# Altium schematic sheet 核心板.SchDoc
size A4; SheetNumber: 1; SheetTotal: 3
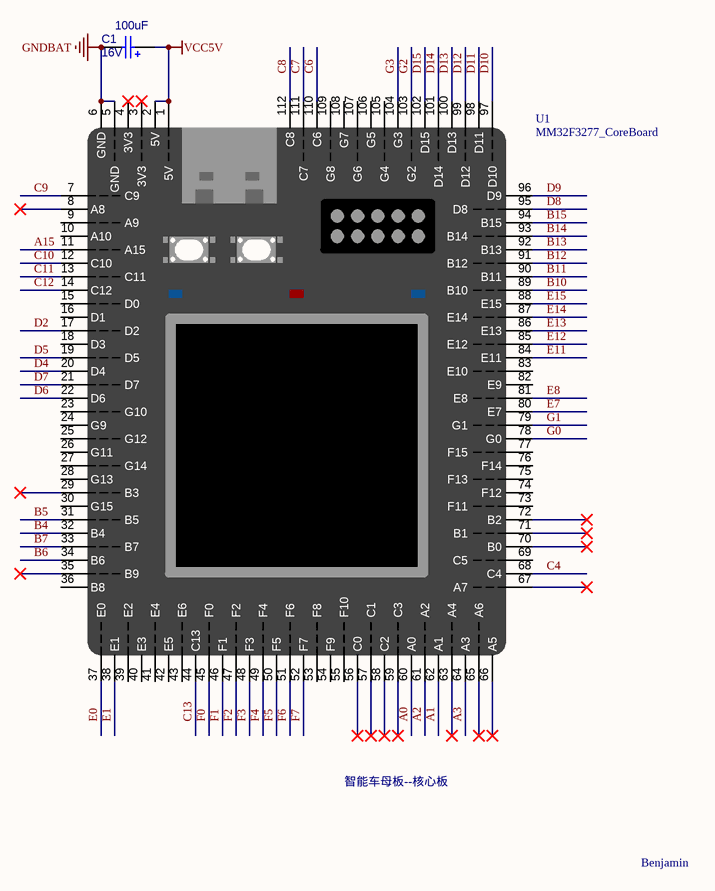
[diagram p0: 核心板.SchDoc]

## Parts
C1  value 100uF  Voltage: 16V  [CAPT3528]  (hidden comment: 100uF 16V)
U1  MM32F3277_CoreBoard  [MM32F3277_CoreBoard]

## Nets
GNDBAT: C1.2 U1.5(GND) U1.6(GND)
VCC5V: C1.1 U1.1(5V) U1.2(5V)
A0: U1.60(A0)
A1: U1.62(A1)
A2: U1.61(A2)
A3: U1.64(A3)
A15: U1.11(A15)
B4: U1.32(B4)
B5: U1.31(B5)
B6: U1.34(B6)
B7: U1.33(B7)
B10: U1.89(B10)
B11: U1.90(B11)
B12: U1.91(B12)
B13: U1.92(B13)
B14: U1.93(B14)
B15: U1.94(B15)
C4: U1.68(C4)
C6: U1.110(C6)
C7: U1.111(C7)
C8: U1.112(C8)
C9: U1.7(C9)
C10: U1.12(C10)
C11: U1.13(C11)
C12: U1.14(C12)
C13: U1.44(C13)
D2: U1.17(D2)
D4: U1.20(D4)
D5: U1.19(D5)
D6: U1.22(D6)
D7: U1.21(D7)
D8: U1.95(D8)
D9: U1.96(D9)
D10: U1.97(D10)
D11: U1.98(D11)
D12: U1.99(D12)
D13: U1.100(D13)
D14: U1.101(D14)
D15: U1.102(D15)
E0: U1.37(E0)
E1: U1.38(E1)
E7: U1.80(E7)
E8: U1.81(E8)
E11: U1.84(E11)
E12: U1.85(E12)
E13: U1.86(E13)
E14: U1.87(E14)
E15: U1.88(E15)
F0: U1.45(F0)
F1: U1.46(F1)
F2: U1.47(F2)
F3: U1.48(F3)
F4: U1.49(F4)
F5: U1.50(F5)
F6: U1.51(F6)
F7: U1.52(F7)
G0: U1.78(G0)
G1: U1.79(G1)
G2: U1.103(G2)
G3: U1.104(G3)

Not connected (* = marked no-connect by the designer): U1 3(3V3)* 4(3V3)* 8(A8)* 9(A9) 10(A10) 15(D0) 16(D1) 18(D3) 23(G10) 24(G9) 25(G12) 26(G11) 27(G14) 28(G13) 29(B3)* 30(G15) 35(B9)* 36(B8) 39(E2) 40(E3) 41(E4) 42(E5) 43(E6) 53(F8) 54(F9) 55(F10) 56(C0)* 57(C1)* 58(C2)* 59(C3)* 63(A4)* 65(A6)* 66(A5)* 67(A7)* 69(C5) 70(B0)* 71(B1)* 72(B2)* 73(F11) 74(F12) 75(F13) 76(F14) 77(F15) 82(E9) 83(E10) 105(G4) 106(G5) 107(G6) 108(G7) 109(G8)

## Notes on the sheet
- 智能车母板--核心板
- Benjamin

## Library data of the parts
C1 = Cap-Tan: Tantalum Capacitor; Published: 8-Jun-2000; Revision: July-2002: Re-released for DXP Platform.; Publisher: Altium Limited; Price(RMB): 0.000
U1 = MM32F3277_CoreBoard: 逐飞科技MM32F3277核心板